# EAGLE design castaway rp2040 (EAGLE 9.5.2)
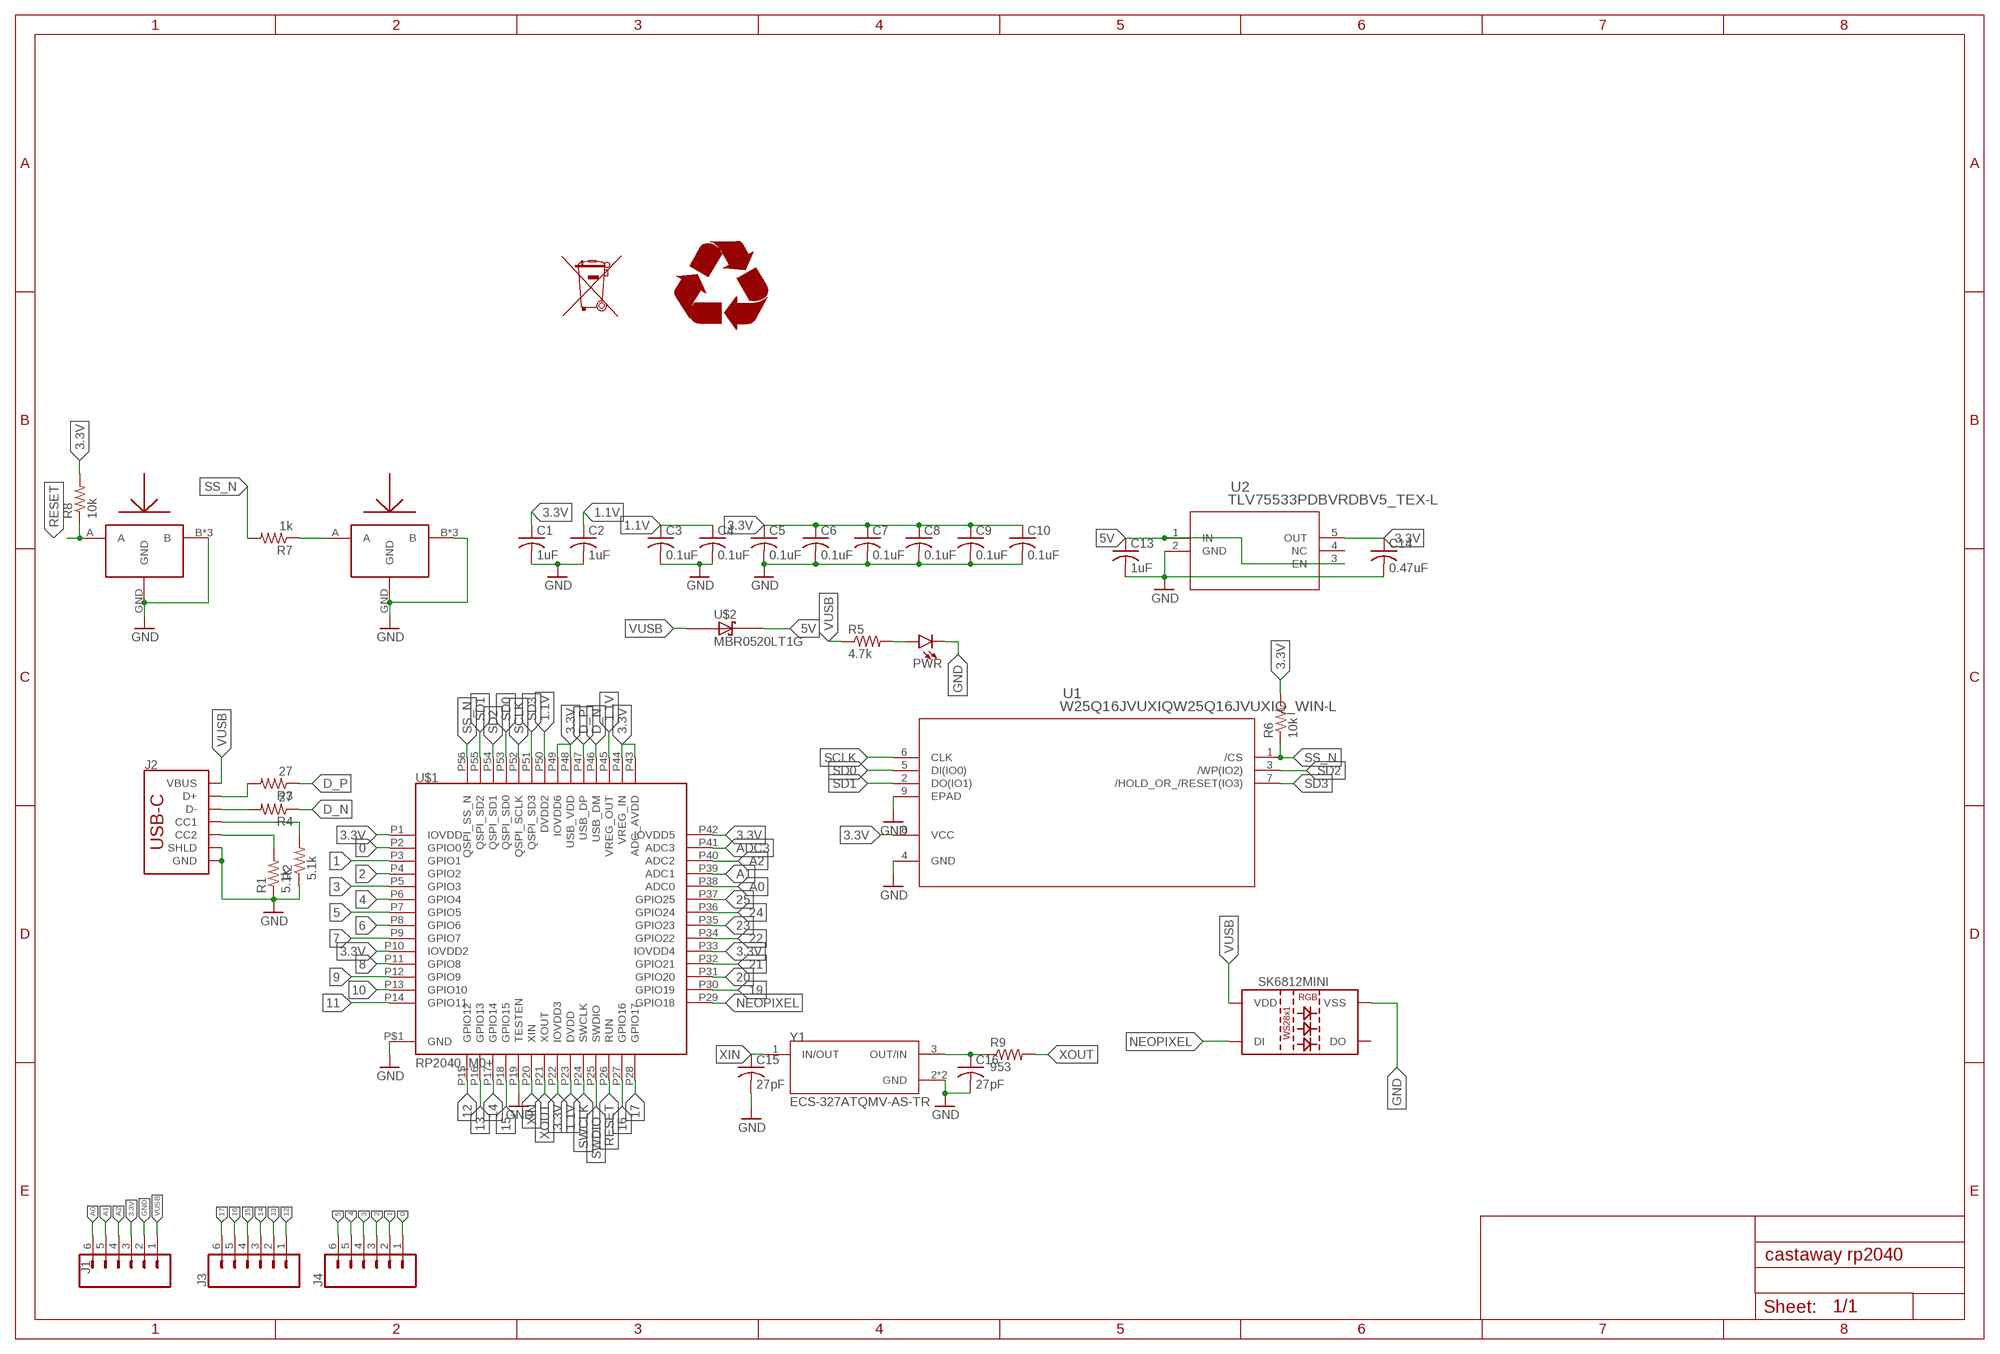
[diagram p0: schematic, sheet 1]

## Parts
C1  1uF  C-USC0603  [C0603]
C2  1uF  C-USC0603  [C0603]
C3  0.1uF  C-USC0603  [C0603]
C4  0.1uF  C-USC0603  [C0603]
C5  0.1uF  C-USC0603  [C0603]
C6  0.1uF  C-USC0603  [C0603]
C7  0.1uF  C-USC0603  [C0603]
C8  0.1uF  C-USC0603  [C0603]
C9  0.1uF  C-USC0603  [C0603]
C10  0.1uF  C-USC0603  [C0603]
C13  1uF  C-USC0603  [C0603]
C14  0.47uF  C-USC0603  [C0603]
C15  27pF  C-USC0402  [C0402]
C16  27pF  C-USC0402  [C0402]
J1  CONN_06LONGPADS  [1X06_LONGPADS]
J2  USB_C_2-LAYER_PADS  [USB-C-16P-2LAYER-PADS]
J3  CONN_06LONGPADS  [1X06_LONGPADS]
J4  CONN_06LONGPADS  [1X06_LONGPADS]
PWR  LED0603  [LED-0603]
R1  5.1k  R-US_R0603  [R0603]
R2  5.1k  R-US_R0603  [R0603]
R3  27  R-US_R0603  [R0603]
R4  27  R-US_R0603  [R0603]
R5  4.7k  R-US_R0603  [R0603]
R6  10k  R-US_R0603  [R0603]
R7  1k  R-US_R0603  [R0603]
R8  10k  R-US_R0603  [R0603]
R9  953  R-US_R0402  [R0402]
SK6812MINI  WS2812BWS2812B-3535  [WS2812-3535]
U1  W25Q16JVUXIQW25Q16JVUXIQ_WIN-L  [W25Q16JVUXIQ_WIN-L]
U2  TLV75533PDBVRDBV5_TEX-L  [DBV5_TEX-L]
U$1  RP2040_M0+  [QFN-56]
U$2  MBR0520LT1G  [SOD3716X117(SOD-123)]
U$3  SOF-232HST  [3.3X2.9]
U$4  SOF-232HST  [3.3X2.9]
Y1  ECS-327ATQMV-AS-TR  [XTAL_ECS-327ATQMV-AS-TR]

## Nets
0: J4.1 U$1.P2(GPIO0)
1: J4.2 U$1.P3(GPIO1)
1.1V: C2.1 C3.1 C4.1 U$1.P23(DVDD) U$1.P45(VREG_OUT) U$1.P50(DVDD2)
2: J4.3 U$1.P4(GPIO2)
3: J4.4 U$1.P5(GPIO3)
3.3V: C1.1 C5.1 C6.1 C7.1 C8.1 C9.1 C10.1 C14.1 J1.3 R6.2 R8.2 U1.8(VCC) U2.5(OUT) U$1.P1(IOVDD) U$1.P10(IOVDD2) U$1.P22(IOVDD3) U$1.P33(IOVDD4) U$1.P42(IOVDD5) U$1.P43(ADC_AVDD) U$1.P44(VREG_IN) U$1.P48(USB_VDD) U$1.P49(IOVDD6)
4: J4.5 U$1.P6(GPIO4)
5: J4.6 U$1.P7(GPIO5)
5V: C13.1 U2.1(IN) U2.3(EN) U$2.1(C)
6: U$1.P8(GPIO6)
7: U$1.P9(GPIO7)
8: U$1.P11(GPIO8)
9: U$1.P12(GPIO9)
10: U$1.P13(GPIO10)
11: U$1.P14(GPIO11)
12: J3.1 U$1.P15(GPIO12)
13: J3.2 U$1.P16(GPIO13)
14: J3.3 U$1.P17(GPIO14)
15: J3.4 U$1.P18(GPIO15)
16: J3.5 U$1.P27(GPIO16)
17: J3.6 U$1.P28(GPIO17)
19: U$1.P30(GPIO19)
20: U$1.P31(GPIO20)
21: U$1.P32(GPIO21)
22: U$1.P34(GPIO22)
23: U$1.P35(GPIO23)
24: U$1.P36(GPIO24)
25: U$1.P37(GPIO25)
A0: J1.6 U$1.P38(ADC0)
A1: J1.5 U$1.P39(ADC1)
A2: J1.4 U$1.P40(ADC2)
ADC3: U$1.P41(ADC3)
D_N: R4.1 U$1.P46(USB_DM)
D_P: R3.1 U$1.P47(USB_DP)
GND: C1.2 C2.2 C3.2 C4.2 C5.2 C6.2 C7.2 C8.2 C9.2 C10.2 C13.2 C14.2 C15.2 C16.2 J1.2 J2.GND J2.GND2(GND) J2.P$1(SHLD) J2.P$2(SHLD) J2.P$3(SHLD) J2.P$4(SHLD) J2.SHLD1(SHLD) J2.SHLD2(SHLD) J2.SHLD3(SHLD) J2.SHLD4(SHLD) PWR.C R1.1 R2.1 SK6812MINI.VSS U1.4(GND) U1.9(EPAD) U2.2(GND) U$1.P19(TESTEN) U$1.P$1(GND) U$3.B U$3.B2(B) U$3.B3(B) U$3.GND U$4.B U$4.B2(B) U$4.B3(B) U$4.GND Y1.2(GND) Y1.4(GND)
N$1: PWR.A R5.2
N$3: J2.A5(CC1) R2.2
N$4: J2.B5(CC2) R1.2
N$8: C16.1 R9.1 Y1.3(OUT/IN)
N$69: R7.1 U$4.A
NEOPIXEL: SK6812MINI.DIN(DI) U$1.P29(GPIO18)
RESET: R8.1 U$1.P26(RUN) U$3.A
SCLK: U1.6(CLK) U$1.P52(QSPI_SCLK)
SD0: U1.5(DI(IO0)) U$1.P53(QSPI_SD0)
SD1: U1.2(DO(IO1)) U$1.P55(QSPI_SD2)
SD2: U1.3(/WP(IO2)) U$1.P54(QSPI_SD1)
SD3: U1.7(/HOLD_OR_/RESET(IO3)) U$1.P51(QSPI_SD3)
SS_N: R6.1 R7.2 U1.1(/CS) U$1.P56(QSPI_SS_N)
SWCLK: U$1.P24(SWCLK)
SWDIO: U$1.P25(SWDIO)
USB_N: J2.A7(D-) J2.B7(D-) R4.2
USB_P: J2.A6(D+) J2.B6(D+) R3.2
VUSB: J1.1 J2.VBUS1(VBUS) J2.VBUS2(VBUS) R5.1 SK6812MINI.VDD U$2.2(A)
XIN: C15.1 U$1.P20(XIN) Y1.1(IN/OUT)
XOUT: R9.2 U$1.P21(XOUT)
Unconnected: SK6812MINI.DOUT(DO) U2.4(NC)

## Library data of the parts
C1-C10 C13-C16 = rcl:C-US: CAPACITOR, American symbol; SPICEPREFIX: C
J1 J3 J4 = SparkFun-Connectors:CONN_06: Multi connection point. Often used as Generic Header-pin footprint for 0.1 inch spaced/style header connections On any of the 0.1 inch spaced packages, you can populate with these: Break Away Headers - Straight <https://www.sparkfun.com/products/116> (PRT-00116) Break Away Male Headers - Right Angle <https://www.sparkfun.com/products/553> (PRT-00553) Female Headers <https://www.sparkfun.com/products/115> (PRT-00115) Break Away Headers - Machine Pin <https://www.sparkfun.com/products/117> (PRT-00117) Break Away Female Headers - Swiss Machine Pin <https://www.sparkfun.com/products/743> (PRT-00743) Arduino Stackable Header - 6 Pin <https://www.sparkfun.com/products/9280> (PRT-09280) For SCREWTERMINALS and SPRING TERMINALS visit here: Screw Terimnals on SparkFun.com <https://www.sparkfun.com/search/results?term=Screw+Terminals> (5mm/3.5mm/2.54mm spacing) This device is also useful as a general connection point to wire up your design to another part of your project. Our various solder wires solder well into these plated through hole pads. Hook-Up Wire - Assortment (Stranded, 22 AWG) <https://www.sparkfun.com/products/11375> (PRT-11375) Hook-Up Wire - Assortment (Solid Core, 22 AWG) <https://www.sparkfun.com/products/11367> (PRT-11367) View the entire wire category on our website here <https://www.sparkfun.com/categories/141>
J2 = SparkFun-Connectors:USB_C: USB Type C 16Pin Connector Super Speed pins not available on the 16-pin purely SMD connector so this part is best for USB 2.0 implementations. D1 and D2 are tied together enabling D+/- no matter which way the cable is plugged into the connector. The two channel configuration pins (CC1/2) are exposed. These are normally connected to ground via 5.1k resistors but can be reconfigured for high current/high power applications.; PROD_ID: CONN-14122
PWR = SparkFun-LED:LED: LED (Generic) Standard schematic elements and footprints for 5mm, 3mm, 1206, and 0603 sized LEDs. Generic LEDs with no color specified.; SPICEPREFIX: B
R1-R9 = rcl:R-US_: RESISTOR, American symbol; SPICEPREFIX: R
SK6812MINI = SparkFun-LED:WS2812B: WS2812B SMD addressable RGB LED 5x5mm SMD LED with built-in controller IC. Color: Red/Green/Blue mC Rating: RGB: 390, 660, 180 mcd Forward Voltage: RGB: 2.0, 3.0, 3.0 V Packages:WS2812B SparkFun Products: Blynk Board - ESP8266 <https://www.sparkfun.com/products/13794>
U1 = Winbond SPI Flash:W25Q16JVUXIQ; BUILT_BY: EMA_Colton; COPYRIGHT: Copyright (C) 2018 Accelerated Designs. All rights reserved; DATASHEET: https://www.mouser.com/datasheet/2/949/w25n01gw_reve_021318_unsecured-1489855.pdf; MANUFACTURER_PART_NUMBER: W25Q16JVUXIQ; SOURCELIBRARY: Winbond_2020-03-18; VENDOR: Winbond
U2 = TLV75533pdbvr:TLV75533PDBVR; COPYRIGHT: Copyright (C) 2018 Accelerated Designs. All rights reserved; MANUFACTURER_PART_NUMBER: TLV75533PDBVR; SOURCELIBRARY: TI_2019-06-18; VENDOR: Texas Instruments
U$1 = RP2040_M0:RP2040_M0+
U$2 = MBR0520LT1G:MBR0520LT1G: Surface Mount Schottky Power Rectifier Plastic SOD−123 Package; AVAILABILITY: Unavailable; DESCRIPTION: Diode Schottky 20V 500mA Surface Mount SOD-123; MF: ON Semiconductor; MP: MBR0520LT1G; PACKAGE: SOD-123 ON Semiconductor; PRICE: None
U$3 U$4 = Mitsumi Buttons:SOF-232HST
Y1 = ECS-327ATQMV-AS-TR:ECS-327ATQMV-AS-TR: The ECX-33Q is a miniature SMD Crystal with a 3.2 x 2.5 mm footprint. AEC-Q200 Qualified.; ARROW_ELECTRONICS-PURCHASE-URL: https://snapeda.com/shop?store=Arrow+Electronics&id=3210300; DESCRIPTION: 32.768kHz XO (Standard) CMOS Oscillator 1.62V ~ 3.63V Enable/Disable 4-SMD, No Lead; DIGI-KEY_PART_NUMBER: XC2826CT-ND; MF: ECS Inc.; MOUSER-PURCHASE-URL: https://snapeda.com/shop?store=Mouser&id=3210300; MP: ECS-327ATQMV-AS-TR; PACKAGE: SMD-4 ECS Inc.

## Board
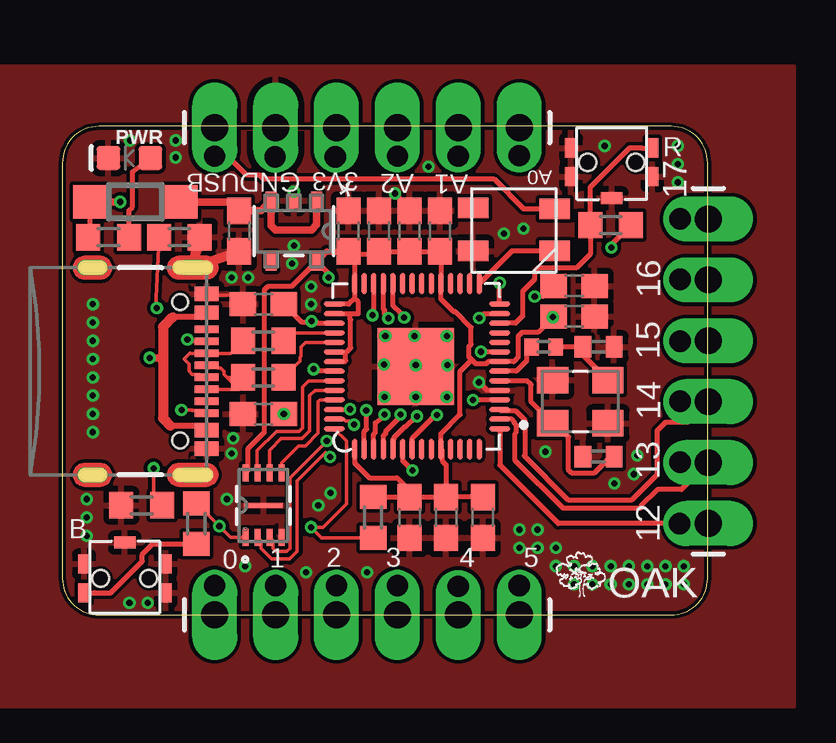
[diagram p1: board, top side]
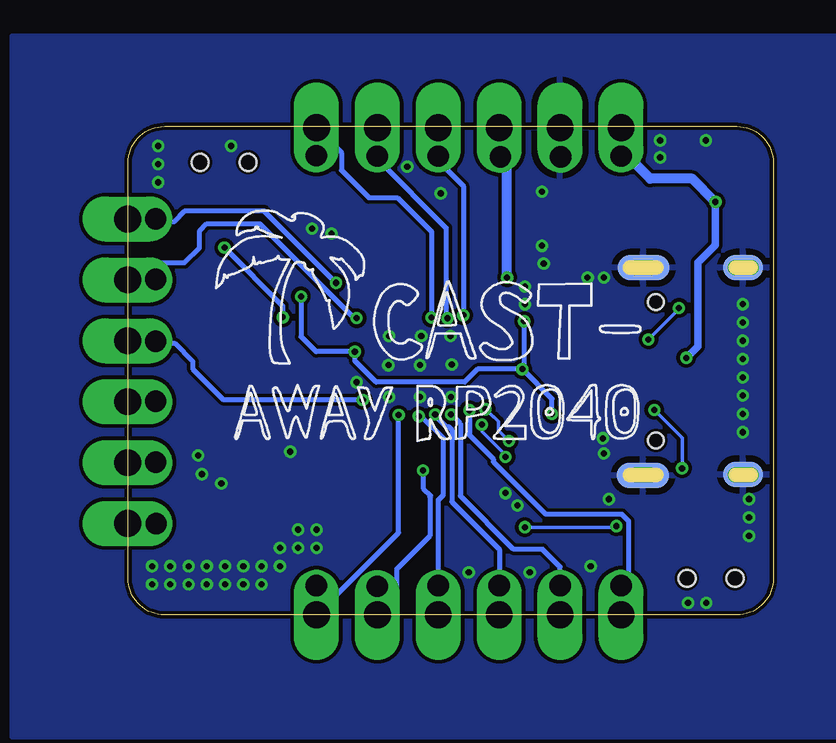
[diagram p2: board, bottom side, seen from below]

Size 26.9 x 20.37 mm. Coordinates in mm from the lower left corner, seen from the top.
Outline: 0,18.85 0,1.52 arc90 1.52,0 25.38,0 arc90 26.9,1.52 26.9,18.85 arc90 25.38,20.37 1.52,20.37 arc90 0,18.85
Copper layers (1*16): Top 0.035mm / dielectric 1.5mm / Bottom 0.035mm
Design rules "default *": minimum track width 6mil, minimum drill 10mil, track to track 6mil, track to pad 6mil, pad to pad 6mil, via to via 6mil, smd to smd 6mil, copper to edge 6mil, drill to drill 6mil, minimum pad ring 5mil, minimum via ring 5mil, stop-mask expansion 1mil, vias tented up to drill 12mil, thermal gap 10mil

### Footprints (pad centres in the part's own frame; a part is rotated, then mirrored left to right if it is on the bottom)
C0603 = smd 1.1 x 1: 1 -0.85,0; 2 0.85,0
C0402 = smd 0.7 x 0.9: 1 -0.65,0; 2 0.65,0
1X06_LONGPADS = drill 1.118 pad 1.88 long: 1 0,0; 2 2.54,0; 3 5.08,0; 4 7.62,0; 5 10.16,0; 6 12.7,0
USB-C-16P-2LAYER-PADS = smd 0.3 x 1: A5 -1.25,-0.34; A6 -0.25,-0.34; A7 0.25,-0.34; A8 1.25,-0.34; B5 1.75,-0.34; B6 0.75,-0.34; B7 -0.75,-0.34; B8 -1.75,-0.34 | smd 0.6 x 1: GND -3.225,-0.34; GND2 3.225,-0.34; VBUS1 -2.45,-0.34; VBUS2 2.45,-0.34 | smd 1.067 x 2.184 bottom: P$1 -4.318,-0.94; P$2 4.343,-0.914 | smd 1.067 x 1.676 bottom: P$3 -4.318,-5.08; P$4 4.293,-5.08 | drill 0.4 pad 0.6 long: SHLD1 -4.318,-0.915; SHLD2 4.318,-0.915; SHLD3 -4.318,-5.095; SHLD4 4.318,-5.095 | hole 0.65: -2.89,-1.445; 2.89,-1.445
LED-0603 = smd 1 x 1: A -0.877,0; C 0.877,0
R0603 = smd 1 x 1.1: 1 -0.85,0; 2 0.85,0
R0402 = smd 0.6 x 0.7: 1 -0.5,0; 2 0.5,0
WS2812-3535 = smd 1.27 x 0.85: DIN 0.05,2.6; DOUT 3.45,0.8; VDD 0.05,0.85; VSS 3.45,2.6
W25Q16JVUXIQ_WIN-L = smd 0.711 x 0.254: 1 -1.348,0.75; 2 -1.348,0.25; 3 -1.348,-0.25; 4 -1.348,-0.75; 5 1.348,-0.75; 6 1.348,-0.25; 7 1.348,0.25; 8 1.348,0.75 | smd 0.203 x 1.6: 9 0,0
DBV5_TEX-L = smd 0.775 x 0.457: 1 -1.264,0.95; 2 -1.264,0; 3 -1.264,-0.95; 4 1.264,-0.95; 5 1.264,0.95
QFN-56 = smd 0.875 x 0.2: P1 -3.5,2.55; P2 -3.5,2.15; P3 -3.5,1.75; P4 -3.5,1.35; P5 -3.5,0.95; P6 -3.5,0.55; P7 -3.5,0.15; P8 -3.5,-0.25; P9 -3.5,-0.65; P10 -3.5,-1.05; P11 -3.5,-1.45; P12 -3.5,-1.85; P13 -3.5,-2.25; P14 -3.5,-2.65; P29 3.4,-2.65; P30 3.4,-2.25; P31 3.4,-1.85; P32 3.4,-1.45; P33 3.4,-1.05; P34 3.4,-0.65; P35 3.4,-0.25; P36 3.4,0.15; P37 3.4,0.55; P38 3.4,0.95; P39 3.4,1.35; P40 3.4,1.75; P41 3.4,2.15; P42 3.4,2.55 | smd 0.2 x 0.875: P15 -2.65,-3.5; P16 -2.25,-3.5; P17 -1.85,-3.5; P18 -1.45,-3.5; P19 -1.05,-3.5; P20 -0.65,-3.5; P21 -0.25,-3.5; P22 0.15,-3.5; P23 0.55,-3.5; P24 0.95,-3.5; P25 1.35,-3.5; P26 1.75,-3.5; P27 2.15,-3.5; P28 2.55,-3.5; P43 2.55,3.4; P44 2.15,3.4; P45 1.75,3.4; P46 1.35,3.4; P47 0.95,3.4; P48 0.55,3.4; P49 0.15,3.4; P50 -0.25,3.4; P51 -0.65,3.4; P52 -1.05,3.4; P53 -1.45,3.4; P54 -1.85,3.4; P55 -2.25,3.4; P56 -2.65,3.4 | smd 3.2 x 3.2: P$1 -0.05,0
SOD3716X117(SOD-123) = smd 1.4 x 1.4: 1 -1.9,0.051; 2 1.9,0.051
3.3X2.9 = smd 0.5 x 0.8: A -0.7,-0.6; B2 2.7,0.6; B3 2.7,-0.6; GND -0.7,0.6 | smd 0.9 x 0.5: B 1,1.5 | hole 0.7: 0,0; 2,0
XTAL_ECS-327ATQMV-AS-TR = smd 1.3 x 1.1: 1 -1.15,-0.9; 2 1.15,-0.9; 3 1.15,0.9; 4 -1.15,0.9

### Placement (x,y rotation side)
C1  13.21,16 90 top
C2  8.38,12.95 180 top
C3  8.38,8.38 180 top
C4  21.34,13.72 0 top
C5  14.48,16 90 top
C6  21.34,12.45 0 top
C7  17.53,4.06 270 top
C8  15.75,16 90 top
C9  16,4.06 270 top
C10  14.48,4.06 270 top
C13  7.37,16 270 top
C14  11.94,16 90 top
C15  22.35,6.6 180 top
C16  22.35,11.18 0 top
J1  6.35,20.32 0 top
J2  6.35,10.16 270 top
J3  26.92,3.81 90 top
J4  6.35,0 0 top
PWR  2.79,19.05 180 top
R1  3.3,4.57 0 top
R2  4.88,15.75 180 top
R3  8.38,9.91 180 top
R4  8.38,11.43 180 top
R5  1.93,15.75 0 top
R6  12.95,4.06 90 top
R7  5.59,3.81 90 top
R8  22.86,16.26 0 top
R9  20.07,11.18 180 top
SK6812MINI  20.57,17.78 180 top
U1  8.38,4.57 90 top
U2  9.65,16 270 top
U$1  14.73,10.41 90 top
U$2  3.05,17.27 180 top
U$3  23.9,18.87 180 top
U$4  1.6,1.52 0 top
Y1  21.59,8.89 0 top

### Tracks (layer width: path | path; a pad name or v marks a point on that pad's centre or on a via)
0  (via drill 0.25, 0.89)
  Top 0.203: U$1.P2 12.58,7.64 12.69,7.75 12.69,8.35 12.67,8.37 v12.67,8.53 | J4.1 v6.35,1.22
  Bottom 0.203: v12.67,8.53 12.67,7.5 11.67,6.5 11.67,6.38 9.5,4.21 6.34,4.21 6.04,3.91 6.04,0.57 6.35,0.25 J4.1
1  (via drill 0.25, 0.89)
  Top 0.203: v13.43,8.36 13.43,8.29 13.05,8.01 13.05,7.6 12.98,7.54 12.98,7.52 U$1.P3 | J4.2 v8.89,1.22
  Bottom 0.203: J4.2 v8.89,1.22 8.89,2.01 9.63,2.74 10.83,2.74 13.05,4.97 13.05,7.98 v13.43,8.36
1.1V  (via drill 0.25)
  Top 0.203: C2.1 9.97,12.22 10.39,12.22 | U$1.P45 10.67,12.16 10.62,12.22 10.39,12.22 | U$1.P50 10.55,10.16 v10.47,10.25 | v10.39,12.25 10.39,12.22 | C4.1 20.05,13.28 v19.69,13.28 | v17.45,10.97 18.22,10.97 U$1.P23
  Bottom 0.203: v10.47,10.25 10.39,10.33 v10.39,12.25 | v19.69,13.28 19.69,11.6 19.06,10.97 v17.45,10.97 17.45,10.59 16.56,9.7 12.88,9.7 12.33,10.25 v10.47,10.25 | C3.1 9.23,9.01 v10.47,10.25
  other vias: 9.23,8.38
2  (via drill 0.25, 0.89)
  Top 0.203: U$1.P4 13.38,7.47 13.47,7.57 13.47,7.66 14.1,8.28 v14.1,8.36 | J4.3 v11.43,1.22
  Bottom 0.203: v14.1,8.36 14.1,8.3 13.64,7.85 13.54,7.85 13.41,7.72 13.41,4.72 11.43,2.74 11.43,1.42 11.48,1.37 11.48,0.3 11.43,0.25 J4.3
3  (via drill 0.25, 0.89)
  Top 0.203: v14.78,8.28 14.74,8.28 14.31,7.85 14.28,7.85 13.83,7.4 13.83,7.36 13.78,7.31 | J4.4 v13.97,1.22 | U$1.P5 13.78,7.31 | 13.78,7.31 13.83,7.36
  Bottom 0.203: J4.4 v13.97,1.22 13.97,4.8 13.76,5 13.76,7.38 14.66,8.28 v14.78,8.28
3.3V  (via drill 0.25, 0.89)
  Top 0.203: C14.1 12.06,15.03 | 12.06,15.03 12.18,14.91 U$1.P42 12.18,13.2 | 12.18,13.2 11.94,12.95 11.34,12.95 U$1.P43 | U$1.P44 11.99,12.56 | 11.99,12.56 12.34,12.56 12.34,12.57 12.34,13.04 12.18,13.2 | U$1.P48 11.81,10.96 | 11.81,10.96 11.85,10.96 12.02,11.13 12.02,12.31 11.99,12.35 11.99,12.56 | U$1.P49 11.77,10.56 11.81,10.61 11.81,10.96 | U$1.P1 12.18,6.33 12.8,5.71 13.95,5.71 14.61,5.05 14.61,4.91 | R6.2 C10.1 14.61,4.91 | C9.1 16,6.26 15.83,6.43 15.83,6.87 U$1.P10 15.78,7.55 16.59,8.36 16.59,10.16 17.04,10.61 17.04,10.66 | C7.1 C9.1 | 12.06,15.03 13.09,15.03 C1.1 C5.1 C8.1 15.78,15.12 U$1.P33 15.78,13.17 16.31,12.65 16.38,12.65 17.04,11.99 17.04,11.29 16.94,11.18 16.94,10.76 17.04,10.66 | C6.1 v20.45,12.41 19.82,11.78 19.16,11.78 19,11.62 19,10.74 18.82,10.56 U$1.P22 17.76,10.56 17.66,10.46 17.24,10.46 17.04,10.66 | 14.61,4.91 C9.1 | U1.8 7.75,6.04 7.75,6.95 8.43,7.62 8.43,13.56 8.58,13.71 9.57,13.71 U2.5 11.1,14.24 v11.1,14.07 | R8.2 22.89,15.43 v22.89,15.32 | J1.3 11.43,19.15 v11.38,19.1
  Top 0.254: U2.5 11.02,15.15 C14.1
  Bottom 0.203: v22.89,15.32 20.45,12.88 v20.45,12.41
  Bottom 0.406: v11.1,14.07 11.1,19.23 11.46,19.58 11.46,20.3 J1.3
4  (via drill 0.25, 0.89)
  Top 0.203: U$1.P6 14.18,6.44 v14.6,6.02 | J4.5 v16.51,1.19
  Bottom 0.203: v14.6,6.02 14.6,5.28 14.29,4.96 14.33,4.92 14.33,3.3 15.7,1.93 15.7,0.81 J4.5
5  (via drill 0.25, 0.89)
  Top 0.203: v15.62,8.33 15.55,8.33 14.58,7.36 U$1.P7 | J4.6 v19.05,1.22
  Bottom 0.203: J4.6 15.62,3.43 v15.62,8.33
5V
  Top 0.305: U$2.1 7,17.22 C13.1 8.29,16.85 U2.3 8.7,16.24 8.89,16.05 10.39,16.05 10.6,16.27 U2.1
12  (via drill 0.89)
  Top 0.203: U$1.P15 18.24,6.25 20.68,3.81 v25.73,3.81 J3.1
13  (via drill 0.89)
  Top 0.203: U$1.P16 18.73,8.16 18.85,8.05 18.85,7.99 18.92,7.91 18.92,7.62 18.87,7.57 18.87,6.45 20.88,4.45 24.11,4.45 24.11,4.52 24.82,5.23 25.81,5.23 J3.2 26.9,6.38 v25.76,6.38
14  (via drill 0.89)
  Top 0.203: U$1.P17 18.28,8.52 18.88,8.52 19.28,8.12 19.28,6.66 19.25,6.63 21.08,4.8 23.75,4.8 24.79,5.84 24.79,7.67 25.15,8.03 26.06,8.03 J3.3 25.78,8.89 v25.76,8.91
15  (via drill 0.25, 0.89)
  Top 0.203: U$1.P18 v17.12,8.96 v17.12,8.97 | J3.4 25.78,11.43 v25.76,11.4
  Bottom 0.203: v17.12,8.97 22.91,8.97 24.21,10.26 24.21,10.57 24.97,11.33 26.82,11.33 J3.4
16  (via drill 0.25, 0.89)
  Top 0.203: v17.38,12.37 17.57,12.56 U$1.P27 | J3.5 25.78,13.97 v25.76,13.99
  Bottom 0.203: J3.5 26.21,14.68 24.56,14.68 23.93,15.32 23.93,16 23.62,16.31 21.41,16.31 17.48,12.37 v17.38,12.37
17  (via drill 0.25, 0.89)
  Top 0.203: U$1.P28 v18.23,13.85 | J3.6 v25.76,16.51
  Bottom 0.203: v18.23,13.85 21.23,16.84 24.54,16.84 24.97,16.41 26.82,16.41 J3.6
A0  (via drill 0.25, 0.89)
  Top 0.203: v14.25,12.39 14.1,12.55 14.1,12.58 13.79,12.89 13.79,13.8 U$1.P38 | J1.6 v19.05,19.15
  Bottom 0.203: J1.6 18.01,19.28 18.01,18.54 16.87,17.4 15.67,17.4 14.25,15.98 v14.25,12.39
A1  (via drill 0.25, 0.89)
  Top 0.203: v13.59,12.37 13.44,12.52 13.44,12.71 13.38,12.76 U$1.P39 | J1.5 v16.51,19.13
  Bottom 0.203: J1.5 v16.51,19.13 16.51,19 13.64,16.13 13.64,12.42 v13.59,12.37
A2  (via drill 0.25, 0.89)
  Top 0.203: v12.93,12.5 12.98,12.55 U$1.P40 | J1.4 v13.97,19.13
  Bottom 0.203: J1.4 v13.97,19.13 13.97,18.92 12.93,17.88 v12.93,12.5
D_N
  Top 0.152: R4.1 9.57,11.76 U$1.P46
D_P
  Top 0.152: R3.1 9.91,10.58 9.91,10.73 9.96,10.79 9.96,11.18 10.15,11.36 U$1.P47
GND  (via drill 0.25, 0.89)
  Top 0.152: J2.GND 6.35,13.34 6.99,13.34 C2.2 | U$4.B2 4.45,1.91 4.28,2.15
  Top 0.203: J1.2 8.89,19.13 v8.87,19.1 | U$1.P19 17.71,9.36 v17.37,9.7 | v13.87,17.58 14.48,16.97 C5.2
  Top 0.406: R2.1 J2.SHLD1 C13.2
  other vias: 14.73,9.09 16.03,9.09 16.05,10.41 16.03,11.63 14.68,11.63 13.46,11.63 13.41,10.44 13.44,9.09 14.73,10.41 25.65,19.56 25.65,18.8 25.65,18.03 22.61,19.56 25.91,2.03 25.91,1.27 25.15,1.27 25.15,2.03 24.38,2.03 24.38,1.27 23.62,1.27 23.62,2.03 22.86,2.03 22.86,1.27 22.1,1.27 22.1,2.03 21.34,2.03 21.34,1.27 20.57,2.03 20.57,2.79 19.81,2.79 19.05,2.79 19.05,3.56 19.81,3.56 3.56,0.51 2.79,0.51 7.62,2.03 10.16,1.78 11.18,5.08 10.67,4.57 6.86,4.83 12.7,1.78 20.14,6.81 23.01,5.49 23.83,5.87 23.98,6.65 1.27,7.62 1.27,8.38 1.27,9.14 1.27,9.91 1.27,10.67 1.27,11.43 1.27,12.19 1.27,12.95 1.02,4.83 1.02,4.06 1.02,3.3 2.82,19.79 4.72,19.79 4.72,19.08 9.65,15.39 9.58,14.66 9.65,17.65 7.06,14.07 7.75,14.07 10.36,13.69 10.36,12.95 18.41,15.9 19.23,16.1 15.27,18.69 7.11,7.37 7.06,6.73
  pour Top: -3.81,22.86 30.48,22.86 30.48,-3.81 -3.81,-3.81
  pour Bottom: -5.08,24.13 31.75,24.13 31.75,-5.08 -5.08,-5.08
N$1
  Top 0.203: R5.2 2.78,16.87 2.92,17.01 2.92,18.48 PWR.A
N$3  (via drill 0.25)
  Top 0.152: J2.A5 5.29,11.41 v5.21,11.48 | v3.94,12.8 3.9,12.8 R2.2
  Bottom 0.152: v3.94,12.8 3.94,12.76 v5.21,11.48
N$4  (via drill 0.25)
  Top 0.152: R1.2 3.8,4.92 v3.8,6.12 | v4.96,8.55 5.4,8.55 5.42,8.53 5.89,8.53 J2.B5
  Bottom 0.152: v3.8,6.12 3.8,7.38 v4.96,8.55
N$8
  Top 0.203: Y1.3 21.7,10.83 C16.1 R9.1
N$69
  Top 0.203: U$4.A 1.35,0.92 2.01,0.92 3.33,2.23 3.33,2.52 3.77,2.96 R7.1
NEOPIXEL
  Top 0.203: SK6812MINI.DIN 18.75,15.18 U$1.P29
RESET
  Top 0.203: U$1.P26 18.89,12.16 19.18,12.45 19.18,13.49 19.68,13.98 19.68,14.32 19.83,14.47 21.43,14.47 22.01,15.05 R8.1 22.01,17.84 23.65,19.48 24.15,19.48 24.16,19.47 U$3.A
SCLK
  Top 0.152: U$1.P52 10.54,9.36 10.31,9.14 10.31,7.66 10,7.35 9.13,7.35 8.63,6.85 U1.6
SD0
  Top 0.152: U1.5 9.13,6.34 9.84,7.04 10.13,7.04 10.67,7.58 10.67,8.7 10.67,8.89 10.74,8.96 U$1.P53
SD1  (via drill 0.25)
  Top 0.152: U$1.P55 11.73,8.16 11.8,8.09 12,8.09 v12.16,7.93 | v11.16,6.59 10.98,6.78 10.97,6.78 9.79,5.59 9.79,2.65 9.48,2.33 8.71,2.33 8.28,2.77 8.28,3.08 U1.2
  Bottom 0.152: v12.16,7.93 12.16,7.66 11.16,6.66 v11.16,6.59
SD2  (via drill 0.25)
  Top 0.152: U$1.P54 11.99,8.56 v12,8.58 | v11.03,7.26 9.49,5.72 9.49,2.77 9.35,2.64 8.91,2.64 8.78,2.77 8.78,3.08 U1.3
  Bottom 0.152: v12,8.58 11.68,8.26 11.64,8.26 11.46,8.07 11.46,7.69 v11.03,7.26
SD3
  Top 0.152: U1.7 8.13,6.86 8.92,7.65 9.88,7.65 10.01,7.79 10.01,9.5 10.27,9.76 U$1.P51
SS_N  (via drill 0.25)
  Top 0.152: U1.1 7.02,3.22 v6.55,3.7 R7.2 | R6.1 10.81,3.21 v10.36,3.66 10.87,3.66 11.85,4.64 11.85,7.24 U$1.P56
  Bottom 0.152: v10.36,3.66 6.59,3.66 v6.55,3.7
USB_N
  Top 0.152: R4.2 7.01,10.91 J2.B7 5.35,10.91 5.33,10.92 5.08,10.67 5.28,10.47 5.28,10.16 5.42,10.03 5.72,10.03 5.84,9.91 J2.A7
USB_P
  Top 0.152: R3.2 6.86,9.91 | J2.B6 6.02,9.4 7.37,9.4 6.86,9.91 | J2.A6 6.35,10.41 6.47,10.29 6.61,10.29 6.74,10.15 6.74,10.03 6.86,9.91
VUSB  (via drill 0.25, 0.89)
  Top 0.203: U$2.2 1.15,15.82 R5.1 | SK6812MINI.VDD 19.24,16.93 18.01,18.16 8.4,18.16 8.22,18.34 7.67,18.34 6.45,19.56 6.45,20.22 J1.1 v6.35,19.13
  Top 0.254: J2.VBUS1 5.99,12.61 5.79,12.42 4.6,12.42 | 4.51,7.89 5.83,7.89 J2.VBUS2
  Top 0.305: 4.19,10.57 4.04,10.72 v3.63,10.72 | v2.41,17.22 U$2.2
  Top 0.406: 4.6,12.42 4.19,12.01 4.19,10.57 4.19,8.2 4.51,7.89
  Bottom 0.305: v3.63,10.72 3.15,11.2 3.15,14.68 2.41,15.42 v2.41,17.22
  Bottom 0.406: v2.41,17.22 3.38,18.19 5.13,18.19 6.35,19.41 J1.1
XIN
  Top 0.203: U$1.P20 19.37,9.76 19.54,9.6 19.54,8.89 Y1.1 20.53,7.99 21.1,7.43 21.1,6.05 21.25,5.9 22.16,5.9 22.86,6.6 C15.1
XOUT
  Top 0.203: R9.2 19.36,10.96 19.36,10.6 18.92,10.16 U$1.P21

### Text on the board
tPlace: A0 | USB | GND | 3V3 | A2 | A1 | 17 | 16 | 15 | 14 | 13 | 12 | 0 | 1 | 2 | 3 | 4 | 5 | OAK
tNames: R | B